# Altium schematic sheet 系统电路.SchDoc
size A4
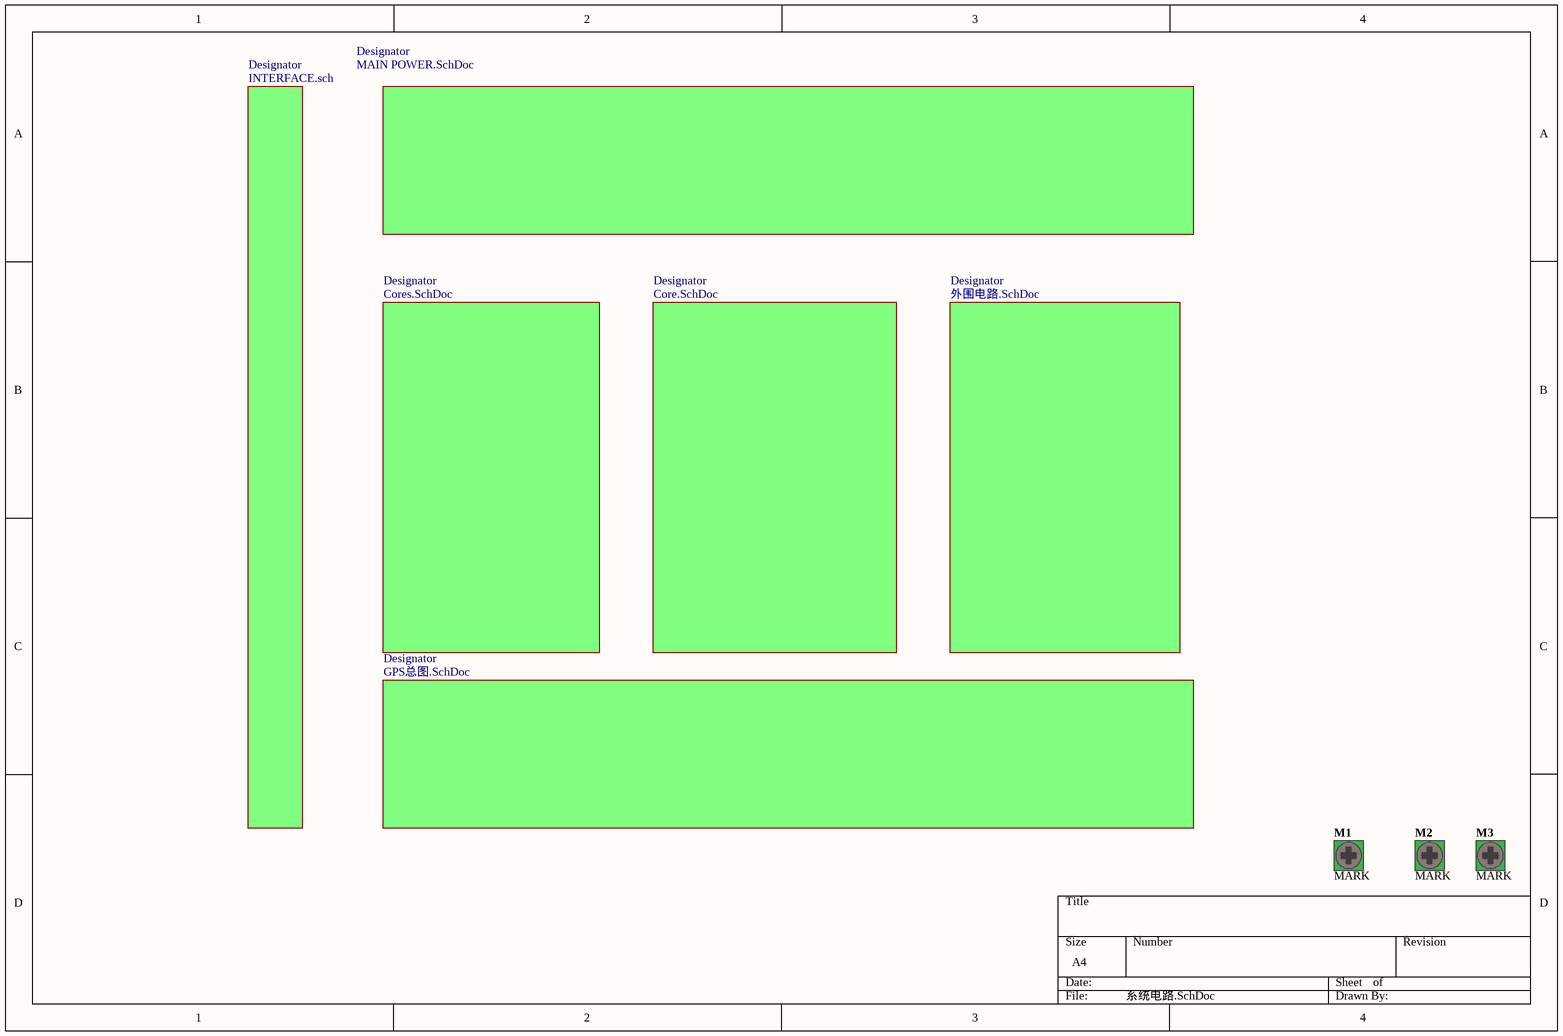
[diagram p0: 系统电路.SchDoc]

## Parts
M1  MARK  [Mark]  (no BOM)
M2  MARK  [Mark]  (no BOM)
M3  MARK  [Mark]  (no BOM)

## Sub-sheets
Designator = Core.SchDoc: no entries
Designator = MAIN POWER.SchDoc: no entries
Designator = Cores.SchDoc: no entries
Designator = 外围电路.SchDoc: no entries
Designator = GPS总图.SchDoc: no entries
Designator = INTERFACE.sch: no entries

## Nets

Not connected (* = marked no-connect by the designer): M1 1; M2 1; M3 1

## Library data of the parts
M1-M3 = D-001-0001: Mounting Hole, M3 Screw, Plated, Square Pad; Status: Production; Category: Mounting-Hole